# EAGLE design supply (EAGLE 9.6.2)
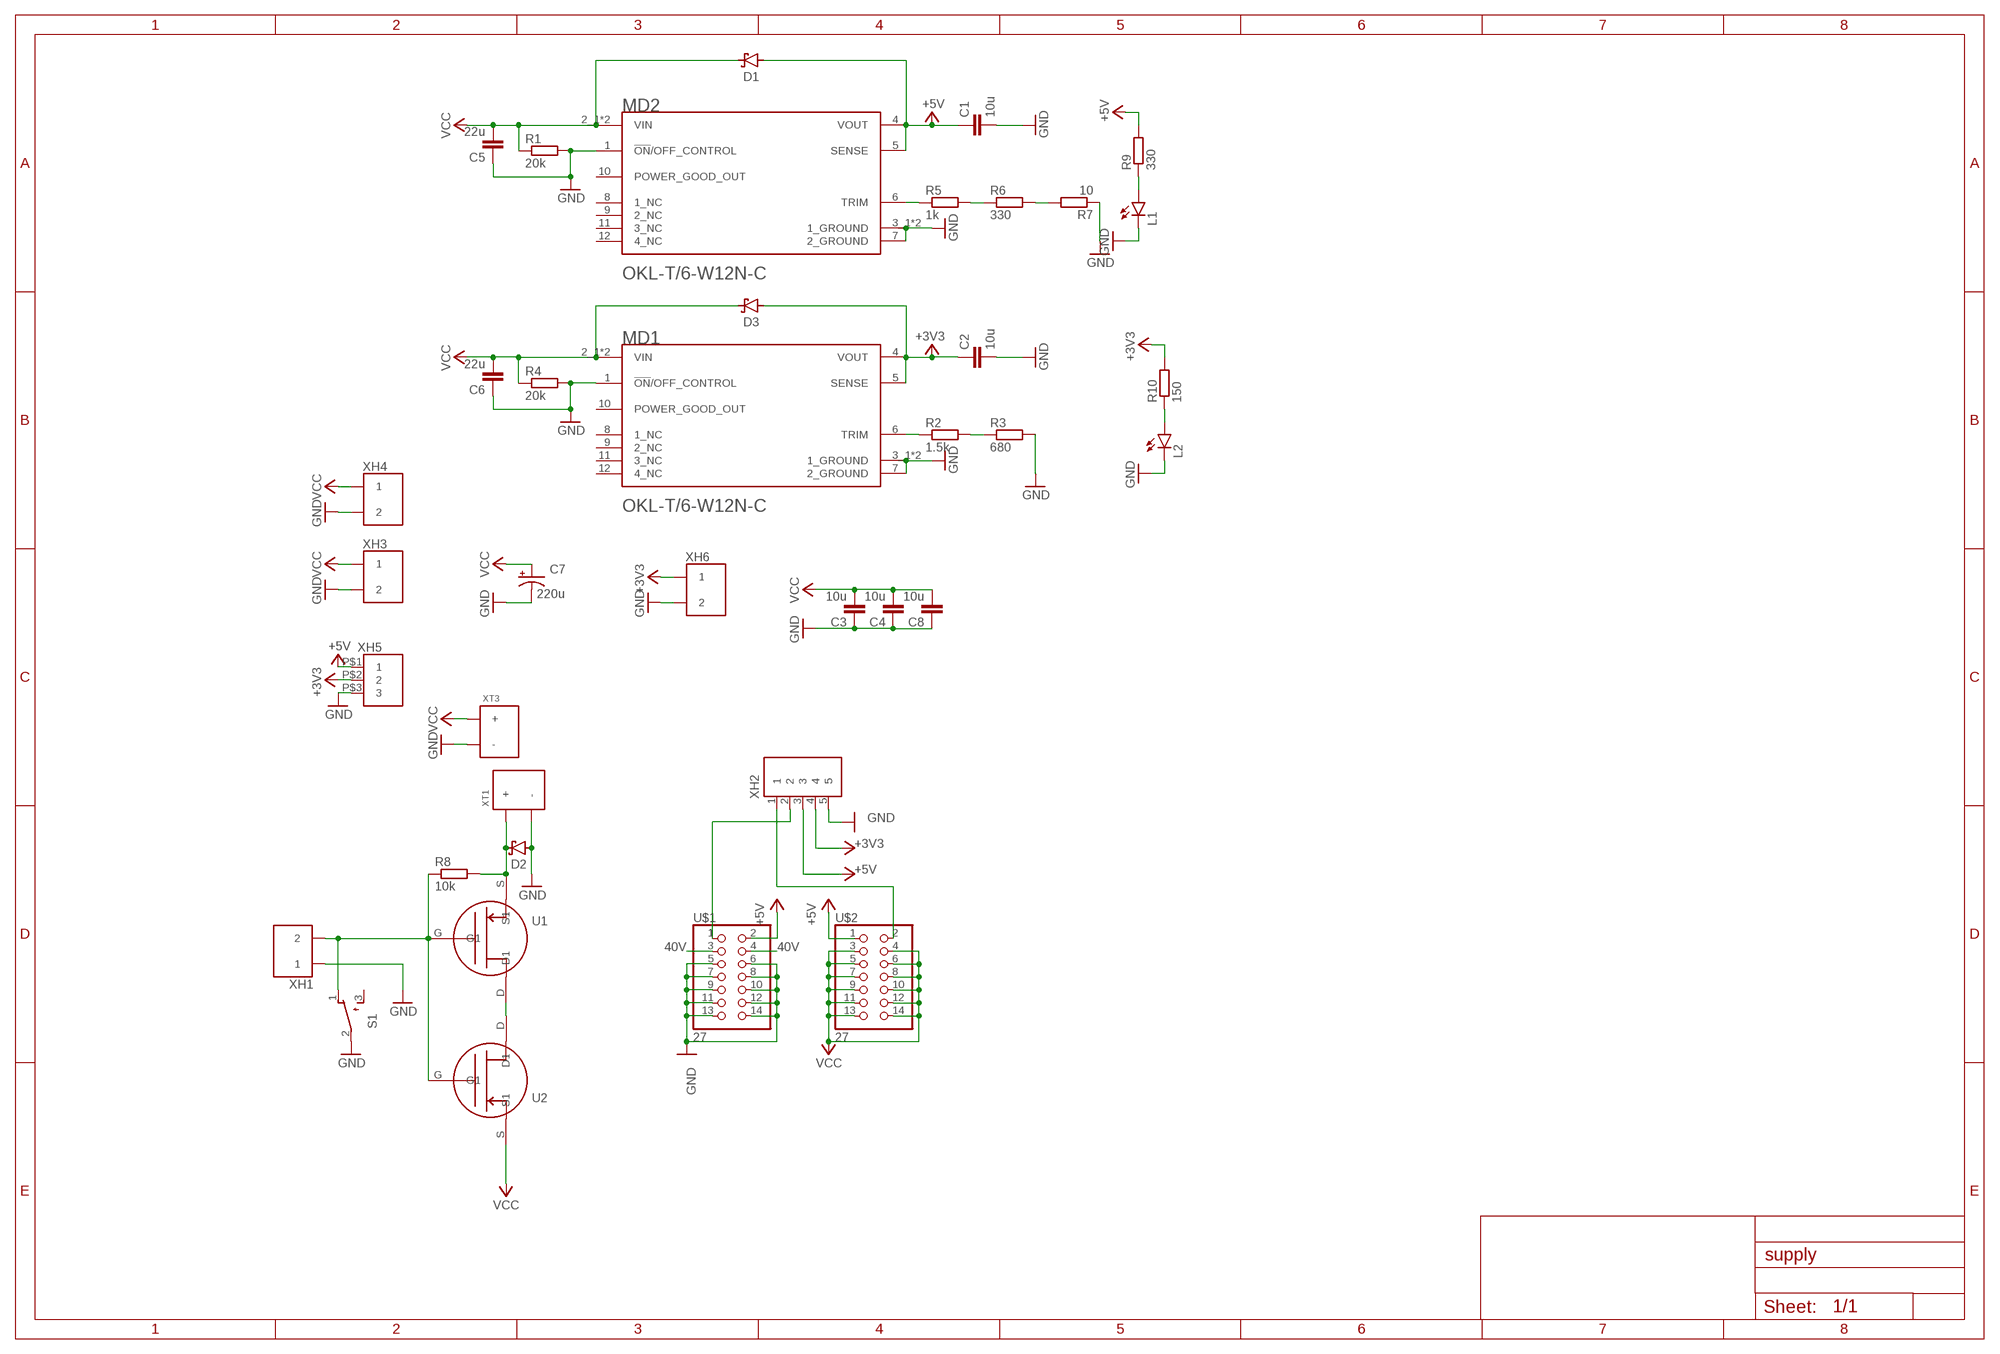
[diagram p0: schematic, sheet 1]

## Parts
C1  10u  C-EUC0805  [C0805]
C2  10u  C-EUC0805  [C0805]
C3  10u  C-EUC0805  [C0805]
C4  10u  C-EUC0805  [C0805]
C5  22u  C-EUC0805  [C0805]
C6  22u  C-EUC0805  [C0805]
C7  220u  UWT1E221MNL1GS  [CAPAE830X1080N]
C8  10u  C-EUC0805  [C0805]
D1  SS2040FL  [SOD123FL]
D2  SS2040FL  [SOD123FL]
D3  SS2040FL  [SOD123FL]
L1  SML-E12P8WT86  [LED_SML-LXFM0603SIC-TR]
L2  SML-E12P8WT86  [LED_SML-LXFM0603SIC-TR]
MD1  OKL-T/6-W12N-CMURATA_OKL-T-6-W12N-C_0_0  [MURATA_OKL-T-6-W12N-C_0]
MD2  OKL-T/6-W12N-CMURATA_OKL-T-6-W12N-C_0_0  [MURATA_OKL-T-6-W12N-C_0]
R1  20k  R-EU_R0603  [R0603]
R2  1.5k  R-EU_R0603  [R0603]
R3  680  R-EU_R0603  [R0603]
R4  20k  R-EU_R0603  [R0603]
R5  1k  R-EU_R0603  [R0603]
R6  330  R-EU_R0603  [R0603]
R7  10  R-EU_R0603  [R0603]
R8  10k  R-EU_R0603  [R0603]
R9  330  R-EU_R0603  [R0603]
R10  150  R-EU_R0603  [R0603]
S1  SS-12SDP2  [SS-12SDP2]
U1  TJ60S04M3L  [DPACK]
U2  TJ60S04M3L  [DPACK]
U$1  27  [2*7]
U$2  27  [2*7]
XH1  2B  [2B]
XH2  5B  [5B]
XH3  2B  [2B]
XH4  2B  [2B]
XH5  3B  [3B]
XH6  2B  [2B]
XT1  XT60U-M  [XT60U-M]
XT3  XT30U-M  [XT30U-M]

## Nets
40V: U$1.3 U$1.4
+3V3: C2.1 D3.A MD1.4(VOUT) MD1.5(SENSE) R10.2 XH2.4 XH5.P$2 XH6.P$1
+5V: C1.1 D1.A MD2.4(VOUT) MD2.5(SENSE) R9.2 U$1.2 U$2.1 XH2.3 XH5.P$1
GND: C1.2 C2.2 C3.1 C4.1 C5.1 C6.1 C7.- C8.1 D2.A L1.C L2.C MD1.1(!ON!/OFF_CONTROL) MD1.3_1(1_GROUND) MD1.3_2(1_GROUND) MD1.7(2_GROUND) MD2.1(!ON!/OFF_CONTROL) MD2.3_1(1_GROUND) MD2.3_2(1_GROUND) MD2.7(2_GROUND) R1.2 R3.2 R4.2 R7.1 S1.2 U$1.5 U$1.6 U$1.7 U$1.8 U$1.9 U$1.10 U$1.11 U$1.12 U$1.13 U$1.14 XH1.P$1 XH2.5 XH3.P$2 XH4.P$2 XH5.P$3 XH6.P$2 XT1.- XT3.-
N$1: MD1.6(TRIM) R2.1
N$2: R2.2 R3.1
N$3: MD2.6(TRIM) R5.1
N$4: R5.2 R6.1
N$5: R6.2 R7.2
N$6: R8.1 S1.1 U1.G(G1) U2.G(G1) XH1.P$2
N$7: D2.C R8.2 U1.S(S1) XT1.+
N$8: U1.D(D1) U2.D(D1)
N$9: U$1.1 XH2.2
N$10: U$2.2 XH2.1
N$11: L1.A R9.1
N$12: L2.A R10.1
VCC: C3.2 C4.2 C5.2 C6.2 C7.+ C8.2 D1.C D3.C MD1.2_1(VIN) MD1.2_2(VIN) MD2.2_1(VIN) MD2.2_2(VIN) R1.1 R4.1 U2.S(S1) U$2.3 U$2.4 U$2.5 U$2.6 U$2.7 U$2.8 U$2.9 U$2.10 U$2.11 U$2.12 U$2.13 U$2.14 XH3.P$1 XH4.P$1 XT3.+
Unconnected: MD1.8(1_NC) MD1.9(2_NC) MD1.10(POWER_GOOD_OUT) MD1.11(3_NC) MD1.12(4_NC) MD2.8(1_NC) MD2.9(2_NC) MD2.10(POWER_GOOD_OUT) MD2.11(3_NC) MD2.12(4_NC) S1.3

## Library data of the parts
C1-C6 C8 = rcl:C-EU: CAPACITOR, European symbol; SPICEPREFIX: C
C7 = capacitor:UWT1E221MNL1GS
D1-D3 = diode:SS2040FL
L1 L2 = LED:SML-E12P8WT86
MD1 MD2 = OKL-T_6-W12N-C:OKL-T/6-W12N-C: Non-Isolated PoL Module DC DC Converter 1 Output 0.591 ~ 5.5V - - 6A 4.5V - 14V Input Check availability <https://pricing.snapeda.com/parts/OKL-T/6-W12N-C/Murata%20Power%20Solutions%20Inc./view-part?ref=eda>; AVAILABILITY: In Stock; DESCRIPTION: Non-Isolated PoL Module DC DC Converter 1 Output 0.591 ~ 5.5V - - 6A 4.5V - 14V Input; MF: Murata Power Solutions Inc.; MP: OKL-T/6-W12N-C; PACKAGE: Murata Power Solutions Inc.; PRICE: None; PURCHASE-URL: https://pricing.snapeda.com/search/part/OKL-T/6-W12N-C/?ref=eda
R1-R10 = rcl:R-EU_: RESISTOR, European symbol; SPICEPREFIX: R
S1 = switch:SS-12SDP2
U1 U2 = P-MOSFET:TJ60S04M3L
U$1 U$2 = pin_socket:2*7
XH1 XH3 XH4 XH6 = XH:2B
XH2 = XH:5B
XH5 = XH:3B
XT1 = XT:XT60U-M
XT3 = XT:XT30U-M

## Board
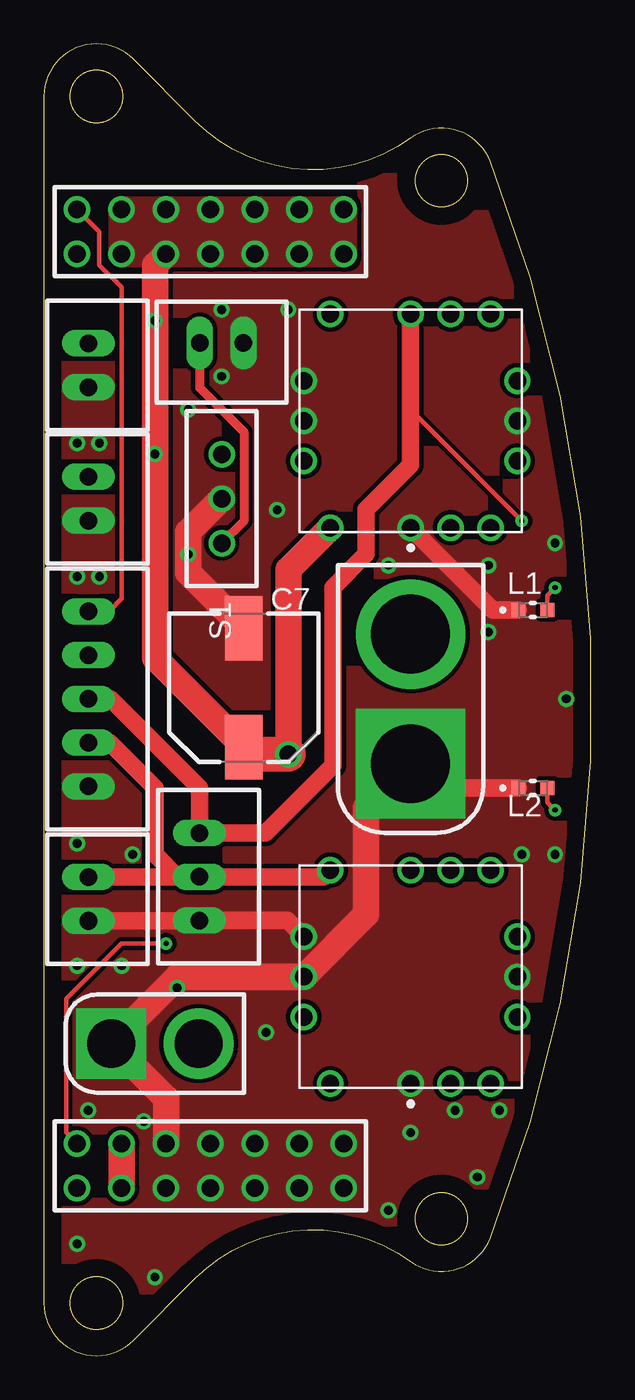
[diagram p1: board, top side]
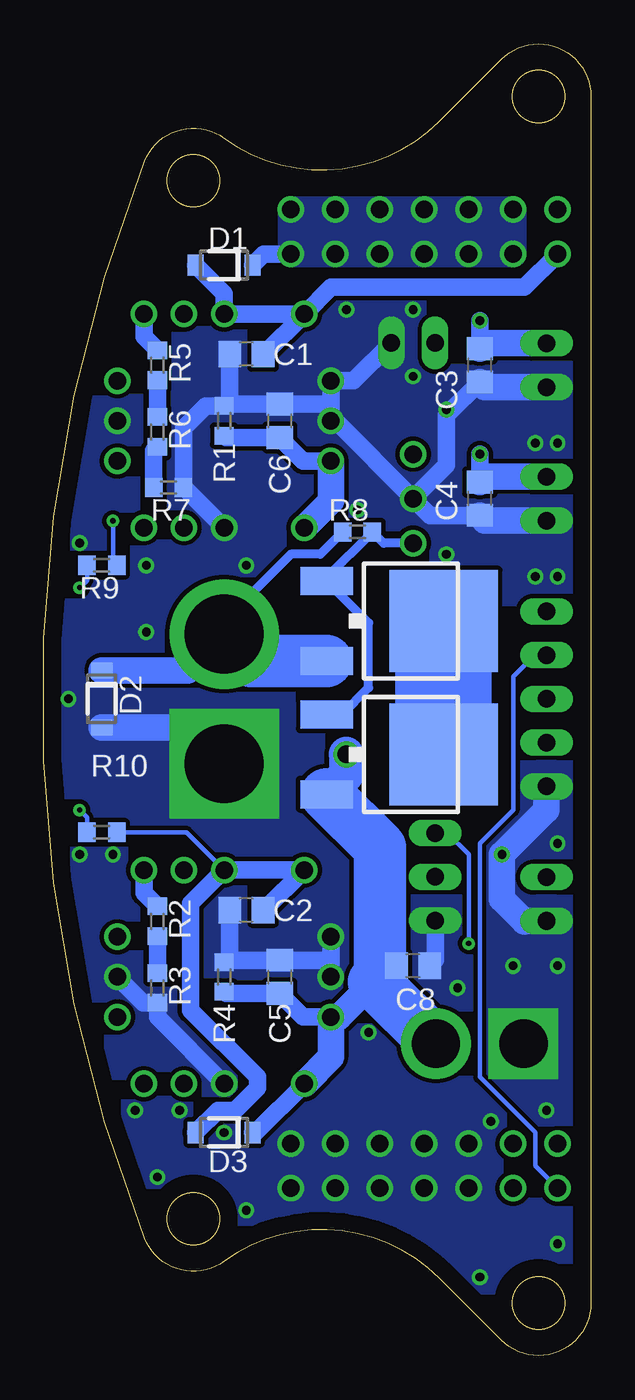
[diagram p2: board, bottom side, seen from below]

Size 31.26 x 74.91 mm. Coordinates in mm from the lower left corner, seen from the top.
Outline: 25.5,68.19 arc104 20.95,69.53
Outline: 20.95,69.53 arc-81 8.66,70.5
Outline: 5.12,74.03 arc135 0,71.91
Outline: 8.66,4.41 arc-81 20.95,5.39
Outline: 20.95,5.39 arc104 25.5,6.72
Outline: 8.66,4.41 5.12,0.88 arc-135 0,3 0,71.91
Outline: 8.66,4.41 arc-81 20.95,5.39
Outline: 20.95,5.39 arc104 25.5,6.72
Outline: 25.5,6.72 arc43 25.5,68.19
Outline: 25.5,68.19 arc104 20.95,69.53
Outline: 20.95,69.53 arc-81 8.66,70.5
Outline: 8.66,70.5 5.12,74.03
Outline: 5.12,74.03 arc135 0,71.91
Outline: circle at 22.71,7.82 radius 1.5
Outline: circle at 3,71.91 radius 1.5
Outline: circle at 22.71,67.1 radius 1.5
Outline: circle at 3,3 radius 1.5
Copper layers (1*16): Top 0.035mm / dielectric 1.5mm / Bottom 0.035mm
Design rules "default *": minimum track width 6mil, minimum drill 0.3mm, track to track 6mil, track to pad 6mil, pad to pad 6mil, via to via 6mil, smd to smd 6mil, copper to edge 40mil, drill to drill 6mil, minimum pad ring 10mil, minimum via ring 8mil, stop-mask expansion 4mil, vias tented up to drill 0mil, thermal gap 10mil

### Footprints (pad centres in the part's own frame; a part is rotated, then mirrored left to right if it is on the bottom)
C0805 = smd 1.3 x 1.5: 1 -0.95,0; 2 0.95,0
CAPAE830X1080N = smd 3.69 x 2.12: + -3.39,0; - 3.39,0
SOD123FL = smd 0.91 x 1.22: A 1.625,0; C -1.625,0
LED_SML-LXFM0603SIC-TR = smd 0.8 x 0.8: A 0.825,0; C -0.825,0
MURATA_OKL-T-6-W12N-C_0 = drill 1: 1 -6.1,0; 2_1 -2.29,6.1; 2_2 -6.1,4.58; 3_1 0,6.1; 3_2 2.29,6.1; 4 6.1,4.58; 5 6.1,0; 6 6.1,-4.58; 7 0,-6.1; 8 -2.29,-6.1; 9 -6.1,-4.58; 10 -6.1,-2.29; 11 6.1,-2.29; 12 2.29,-6.1
R0603 = smd 1 x 1.1: 1 -0.85,0; 2 0.85,0
SS-12SDP2 = drill 1: 1 -2.54,0; 2 0,0; 3 2.54,0
DPACK = smd 5.8 x 6.2: D 0,2.38 | smd 1.6 x 3: G -2.28,-4.3; S 2.28,-4.3
2*7 = drill 1: 1 -1.27,7.62; 2 1.27,7.62; 3 -1.27,5.08; 4 1.27,5.08; 5 -1.27,2.54; 6 1.27,2.54; 7 -1.27,0; 8 1.27,0; 9 -1.27,-2.54; 10 1.27,-2.54; 11 -1.27,-5.08; 12 1.27,-5.08; 13 -1.27,-7.62; 14 1.27,-7.62
2B = drill 1 long: P$1 0,1.25; P$2 0,-1.25
5B = drill 1 long: 1 0,5; 2 0,2.5; 3 0,0; 4 0,-2.5; 5 0,-5
3B = drill 1 long: P$1 0,2.5; P$2 0,0; P$3 0,-2.5
XT60U-M = drill 4.5 pad 6.25: + 3.7,0 | drill 4.5 pad 6.25 square: - -3.7,0
XT30U-M = drill 2.75 pad 4: + 2.5,0 | drill 2.75 pad 4 square: - -2.5,0

### Placement (x,y rotation side)
C1  19.68,57.19 180 bottom
C2  19.68,25.44 180 bottom
C3  6.35,56.56 90 bottom
C4  6.35,48.94 90 bottom
C5  17.78,21.63 270 bottom
C6  17.78,53.38 270 bottom
C7  11.43,38.14 90 top
C8  10.16,22.27 180 bottom
D1  20.95,62.27 180 bottom
D2  27.94,37.51 270 bottom
D3  20.95,12.74 180 bottom
L1  27.94,42.59 0 top
L2  27.94,32.43 0 top
MD1  20.95,21.63 90 top
MD2  20.95,53.38 90 top
R1  20.95,53.38 90 bottom
R2  24.77,24.81 270 bottom
R3  24.77,21 270 bottom
R4  20.95,21.63 90 bottom
R5  24.77,56.56 270 bottom
R6  24.77,52.75 270 bottom
R7  24.13,49.57 180 bottom
R8  13.34,47.03 180 bottom
R9  27.94,45.13 0 bottom
R10  27.94,29.89 0 bottom
S1  10.16,48.94 90 top
U1  10.79,41.95 270 bottom
U2  10.79,34.33 270 bottom
U$1  9.53,10.84 90 top
U$2  9.53,64.18 90 top
XH1  10.16,57.83 270 top
XH2  2.54,37.51 0 top
XH3  2.54,48.94 0 top
XH4  2.54,56.56 0 top
XH5  8.89,27.35 0 top
XH6  2.54,26.08 0 top
XT1  20.95,37.51 90 top
XT3  6.35,17.82 0 top

### Tracks (layer width: path | path; a pad name or v marks a point on that pad's centre or on a via)
40V
  Top 1.5: U$1.3 U$1.4
+3V3
  Top 1: XH2.4 3.77,35.01 6.35,32.43 6.35,28.62 7.62,27.35 XH5.P$2 | XH6.P$1 8.87,27.33 XH5.P$2 | XH5.P$2 15.99,27.35 MD1.4
  Bottom 0.25: MD1.5 23.11,29.89 R10.2
  Bottom 1: D3.A 21.31,14.01 20.32,14.01 19.05,15.28 19.05,15.92 22.86,19.73 22.86,25.83 MD1.5 MD1.4 18.66,25.44 C2.1
+5V  (via drill 0.3)
  Top 0.25: U$1.2 1.27,12.74 1.27,20.36 4.45,23.54 v6.99,23.54 | v27.3,47.67 20.95,54.02
  Top 1: XH2.3 3.81,37.51 8.89,32.43 XH5.P$1 12.66,29.85 16.51,33.7 16.51,43.86 18.41,45.76 18.41,48.3 20.95,50.84 20.95,54.02 MD2.5
  Bottom 0.25: v6.99,23.54 6.99,28.62 8.26,29.89 8.85,29.89 XH5.P$1 | v27.3,47.67 27.3,45.34 R9.2
  Bottom 1: D1.A 20.95,60.65 MD2.5 MD2.4 | MD2.4 18.66,57.19 C1.1 | U$2.1 3.81,61 14.86,61 MD2.4
GND  (via drill 0.5)
  Top 1: XH6.P$2 8.87,24.83 XH5.P$3 13.93,24.85 MD1.3_2 | MD2.1 25.65,42.59 L1.C | L2.C 22.34,32.43 XT1.-
  Top 1.5: U$1.6 6.99,14.69 XT3.- 7.66,21.63 MD1.3_1 18.41,25.19 18.41,31.27 XT1.- | C7.- 8.26,44.71 8.26,47.03 S1.2
  Bottom 1: C2.2 20.64,22.8 | 20.64,22.8 R4.2 | 20.99,15.53 MD1.1 24.77,19.34 R3.2 25.57,20.15 MD1.7 | 20.64,22.8 20.41,22.58 C5.1 15.18,22.58 14.86,22.9 | MD1.3_2 14.86,22.9 | 14.86,22.9 MD1.3_1 | C1.2 20.64,54.55 | 20.64,54.55 R1.2 22.01,54.23 23.28,52.96 R7.1 23.25,49.57 MD2.1 | 20.64,54.55 20.41,54.33 C6.1 15.18,54.33 14.86,54.65 | 14.86,54.65 MD2.3_2 13.56,55.67 XH1.P$1 | 14.86,54.65 MD2.3_1 14.61,53.38 S1.2 | C3.1 8.26,53.7 8.26,50.84 S1.2 | C4.1 9.21,47.99 S1.2 | C8.1 8.89,22.59 XH5.P$3
  Bottom 1.5: XT1.- 23.03,35.88 D2.A | XH3.P$2 6.05,47.69 C4.1 | XH4.P$2 6.05,55.31 C3.1 | XH2.5 2.54,31.16 v5.08,28.62 5.08,26.08 3.81,24.81 3.79,24.83 XH6.P$2
  other vias: 1.91,22.27 4.45,22.27 5.71,13.38 1.91,6.39 6.35,4.49 19.68,8.3 24.77,10.2 26.04,14.01 20.95,12.74 23.5,14.01 12.7,18.46 2.54,14.01 1.91,29.25 1.91,44.49 1.91,52.11 3.17,52.11 3.17,44.49 29.21,28.62 27.3,28.62 25.4,41.32 13.34,48.3 19.68,45.13 8.26,54.02 13.97,59.73 29.21,46.4 29.84,37.51 10.16,55.92 10.16,59.73 8.26,45.76 25.4,45.13 7.62,21
  pour Top (isolate 0.25, rank 2, no thermals): -3.81,79.42 34.29,79.42 34.29,-5.67 -3.81,-5.67
  pour Bottom (isolate 0.25, rank 2, no thermals): -5.08,80.69 33.02,80.69 33.02,-5.67 -5.08,-5.67
N$1
  Bottom 1: MD1.6 25.54,26.43 R2.1
N$2
  Bottom 1: R2.2 R3.1
N$3
  Bottom 1: MD2.6 25.54,58.18 R5.1
N$4
  Bottom 1: R5.2 R6.1
N$5
  Bottom 1: R6.2 24.98,51.68 R7.2
N$6
  Top 0.5: XH1.P$2 8.91,55.27 11.43,52.75 11.43,47.67 S1.1
  Bottom 0.5: U2.G 14.23,36.61 12.7,38.14 12.7,41.84 U1.G 15.1,44.42 R8.1 11.85,46.4 S1.1
N$7
  Bottom 0.5: R8.2 15.46,45.76 17.14,45.76 20.95,41.95 XT1.+
  Bottom 1.5: XT1.+ 23.03,39.13 D2.C
  Bottom 3: U1.S 19.42,39.67 XT1.+
N$8
  Bottom 5.5: U1.D U2.D
N$9
  Bottom 0.25: U$1.1 3.17,10.84 3.17,12.74 6.35,15.92 6.35,29.25 4.45,31.16 4.45,38.78 3.21,40.01 XH2.2
N$10
  Top 0.25: XH2.1 3.73,42.51 4.45,43.22 4.45,61 3.17,62.27 3.17,64.18 U$2.2
N$11  (via drill 0.3)
  Top 0.25: L1.A 28.77,43.41 v29.21,43.86
  Bottom 0.25: v29.21,43.86 28.79,44.28 R9.1
N$12  (via drill 0.3)
  Top 0.25: v29.21,31.16 28.77,31.6 L2.A
  Bottom 0.25: R10.1 28.79,30.74 v29.21,31.16
VCC  (via drill 0.5, 1)
  Top 1.5: v13.97,34.33 13.97,44.88 MD2.2_2 | U$2.5 6.35,62.27 v6.35,59.1 v6.35,51.48 6.35,39.83 C7.+
  Top 2: v13.97,34.33 11.85,34.33 C7.+
  Bottom 1: MD1.2_1 16.44,19.34 C5.2 20.86,20.68 R4.1 | MD2.2_1 16.44,51.09 C6.2 20.86,52.43 R1.1 | MD1.2_2 19.16,12.74 D3.C | U$2.13 18.7,62.91 D1.C | 12.38,21.36 12.06,21.67 | v6.35,59.1 C3.2 | v6.35,51.48 C4.2 | C8.2 11.11,20.08 XT3.+
  Bottom 1.5: 12.38,21.36 14.39,19.34 MD1.2_1 14.86,17.05 MD1.2_2 | MD2.2_1 14.86,48.8 MD2.2_2 | XH3.P$1 6.05,50.19 C4.2 | XH4.P$1 6.05,57.81 C3.2
  Bottom 2: U2.S 13.97,33.18 v13.97,34.33
  Bottom 3: XT3.+ 12.38,21.36 | U2.S 12.06,29.02 12.06,21.67
  pour Top (isolate 0.25, no thermals): 4.45,65.45 4.45,62.91 17.14,62.91 17.14,65.45
  pour Bottom (isolate 0.25, no thermals): 4.45,65.45 4.45,62.91 17.14,62.91 17.14,65.45